# EAGLE schematic projeto_sistemas_embarcados (2) (EAGLE 9.6.2)
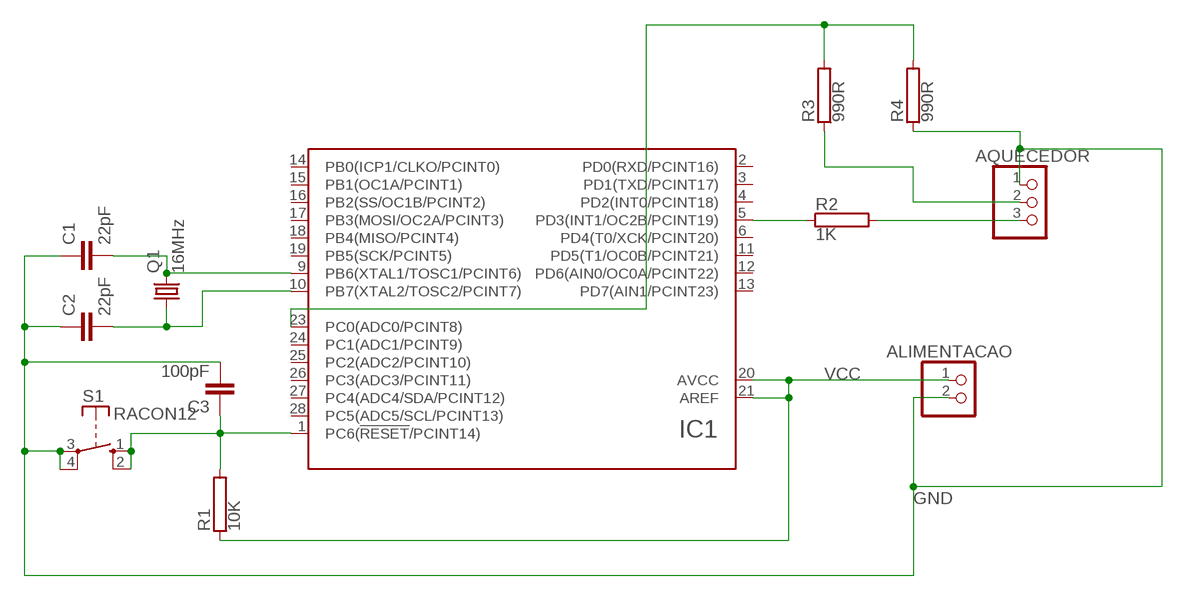
[diagram p0: schematic, sheet 1]

## Parts
ALIMENTACAO  PINHD-1X2  [1X02]
AQUECEDOR  PINHD-1X3  [1X03]
C1  22pF  C2,5-3  [C2.5-3]
C2  22pF  C2,5-3  [C2.5-3]
C3  100pF  C2,5-3  [C2.5-3]
IC1  ATMEGA48/88/168/328-PU(DIP28)PU  [DIL28]
Q1  16MHz  CRYSTALHC49S  [HC49/S]
R1  10K  RAC01  [AC01]
R2  1K  RAC01  [AC01]
R3  990R  RHPS63  [HPS63]
R4  990R  RAC01  [AC01]
S1  RACON12  [RACON12]

## Nets
GND: ALIMENTACAO.2 AQUECEDOR.1 C1.1 C2.1 C3.2 R4.1 S1.3(P) S1.4(P)
N$1: AQUECEDOR.3 R2.2
N$2: C1.2 IC1.9(PB6(XTAL1/TOSC1/PCINT6)) Q1.2
N$3: C2.2 IC1.10(PB7(XTAL2/TOSC2/PCINT7)) Q1.1
N$4: C3.1 IC1.1(PC6(!RESET!/PCINT14)) R1.2 S1.1(S) S1.2(S)
N$5: AQUECEDOR.2 R3.1
N$6: IC1.5(PD3(INT1/OC2B/PCINT19)) R2.1
N$8: IC1.23(PC0(ADC0/PCINT8)) R3.2 R4.2
VCC: ALIMENTACAO.1 IC1.20(AVCC) IC1.21(AREF) R1.1
Unconnected: IC1.2(PD0(RXD/PCINT16)) IC1.3(PD1(TXD/PCINT17)) IC1.4(PD2(INT0/PCINT18)) IC1.6(PD4(T0/XCK/PCINT20)) IC1.11(PD5(T1/OC0B/PCINT21)) IC1.12(PD6(AIN0/OC0A/PCINT22)) IC1.13(PD7(AIN1/PCINT23)) IC1.14(PB0(ICP1/CLKO/PCINT0)) IC1.15(PB1(OC1A/PCINT1)) IC1.16(PB2(SS/OC1B/PCINT2)) IC1.17(PB3(MOSI/OC2A/PCINT3)) IC1.18(PB4(MISO/PCINT4)) IC1.19(PB5(SCK/PCINT5)) IC1.24(PC1(ADC1/PCINT9)) IC1.25(PC2(ADC2/PCINT10)) IC1.26(PC3(ADC3/PCINT11)) IC1.27(PC4(ADC4/SDA/PCINT12)) IC1.28(PC5(ADC5/SCL/PCINT13))

## Power pins joined to a net without a drawn wire
GND: IC1.8(GND) IC1.22(GND)
UCC: IC1.7(UCC)

## Library data of the parts
ALIMENTACAO = pinhead:PINHD-1X2: PIN HEADER
AQUECEDOR = pinhead:PINHD-1X3: PIN HEADER
C1-C3 = capacitor-wima:C: CAPACITOR naming: grid - package width
IC1 = atmel_tiny24-44-84tiny48-88mega48-88-168-328:ATMEGA48/88/168/328-PU(DIP28)
Q1 = crystal:CRYSTAL: CRYSTAL; OC_FARNELL: 1667008; OC_NEWARK: unknown
R1-R4 = resistor-power:R: Power Resitor; OC_FARNELL: unknown; OC_NEWARK: unknown
S1 = switch-misc:RACON12: ITT SWITCH